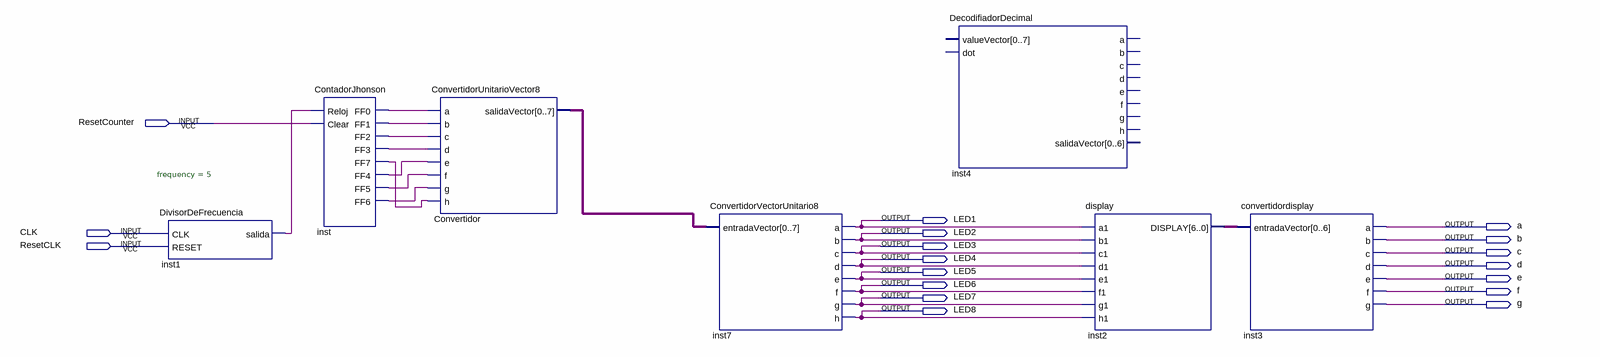
[diagram p0: schematic sheet]
// Quartus schematic Practica5.bdf as structural Verilog: 7 symbols, 18 pins
module Practica5 (
  input  ResetCounter,
  input  CLK,
  input  ResetCLK,
  output LED1,
  output a,
  output LED2,
  output b,
  output LED3,
  output c,
  output LED4,
  output d,
  output LED5,
  output e,
  output LED6,
  output f,
  output LED7,
  output g,
  output LED8
);

  wire inst1_salida, inst_ff0, inst_ff1, inst_ff2, inst_ff3, inst_ff4, inst_ff5, inst_ff6, inst_ff7;
  wire [6:0] inst2_display;
  wire [7:0] Convertidor_salidavector;

  DivisorDeFrecuencia #(.frequency(5)) inst1 (.CLK(CLK), .RESET(ResetCLK), .salida(inst1_salida));
  ContadorJhonson inst (
    .Reloj(inst1_salida), .Clear(ResetCounter), .FF0(inst_ff0), .FF1(inst_ff1), .FF2(inst_ff2),
    .FF3(inst_ff3), .FF7(inst_ff7), .FF4(inst_ff4), .FF5(inst_ff5), .FF6(inst_ff6));
  ConvertidorUnitarioVector8 Convertidor (
    .a(inst_ff0), .b(inst_ff1), .c(inst_ff2), .d(inst_ff3), .e(inst_ff4), .f(inst_ff5), .g(inst_ff6),
    .h(inst_ff7), .salidaVector(Convertidor_salidavector));
  ConvertidorVectorUnitario8 inst7 (
    .entradaVector(Convertidor_salidavector), .a(LED1), .b(LED2), .c(LED3), .d(LED4), .e(LED5), .f(LED6),
    .g(LED7), .h(LED8));
  DecodifiadorDecimal inst4 ();  // open: valueVector, dot, a, b, c, d, e, f, g, h, salidaVector
  display inst2 (
    .a1(LED1), .b1(LED2), .c1(LED3), .d1(LED4), .e1(LED5), .f1(LED6), .g1(LED7), .h1(LED8),
    .DISPLAY(inst2_display));
  convertidordisplay inst3 (.entradaVector(inst2_display), .a(a), .b(b), .c(c), .d(d), .e(e), .f(f), .g(g));
endmodule
